# Altium schematic sheet Sheet_Microcontroller.SchDoc
size A2; Organization: Altium Limited; Address1: L3, 12a Rodborough Rd; Address2: Frenchs Forest; Address3: NSW; Address4: Australia 2086
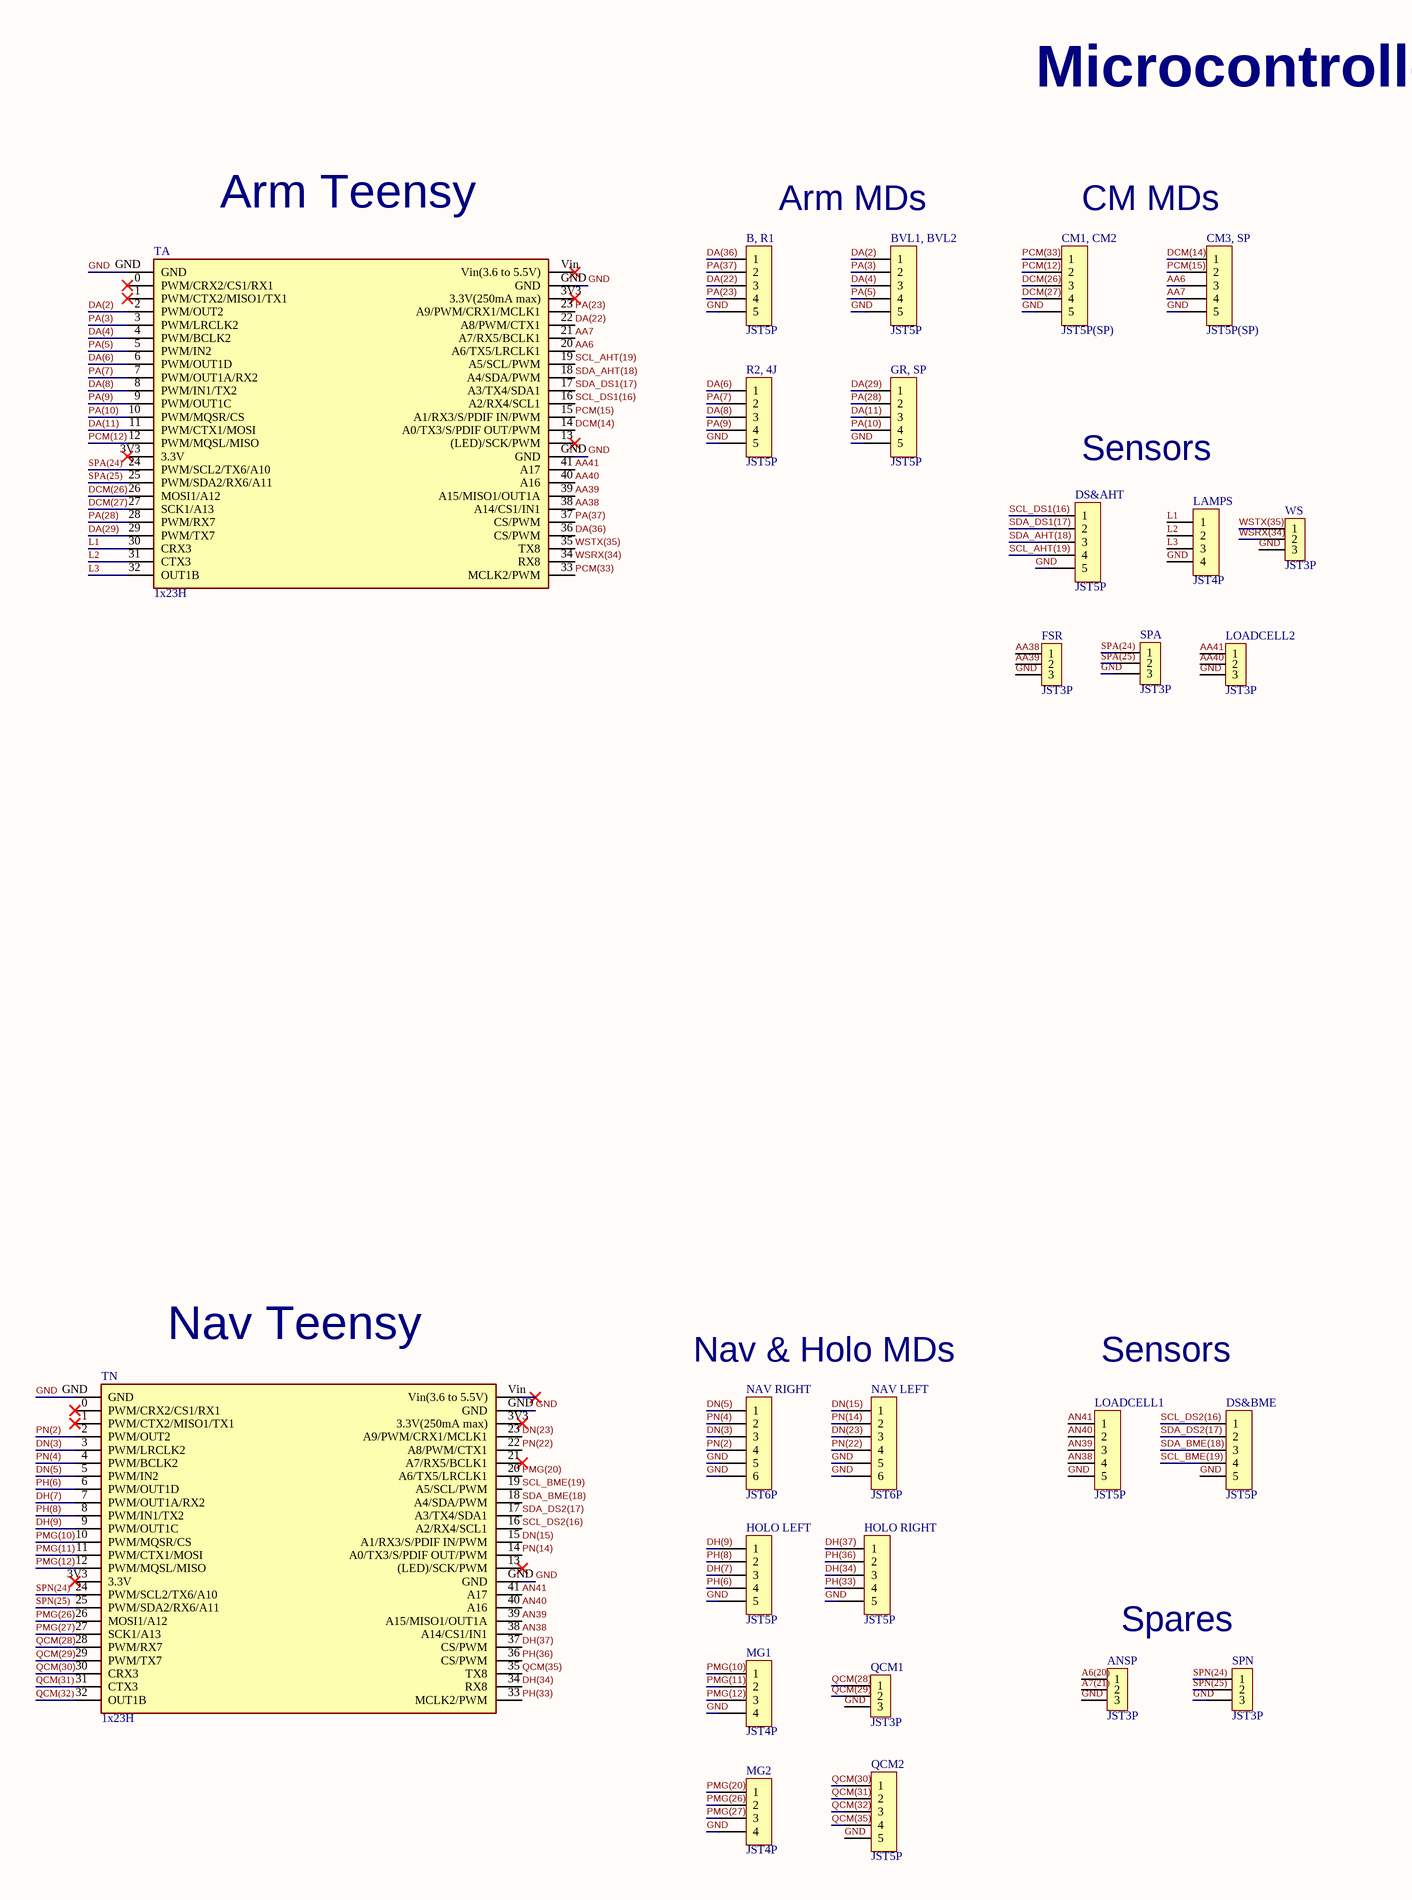
[diagram p0: Sheet_Microcontroller.SchDoc, left]
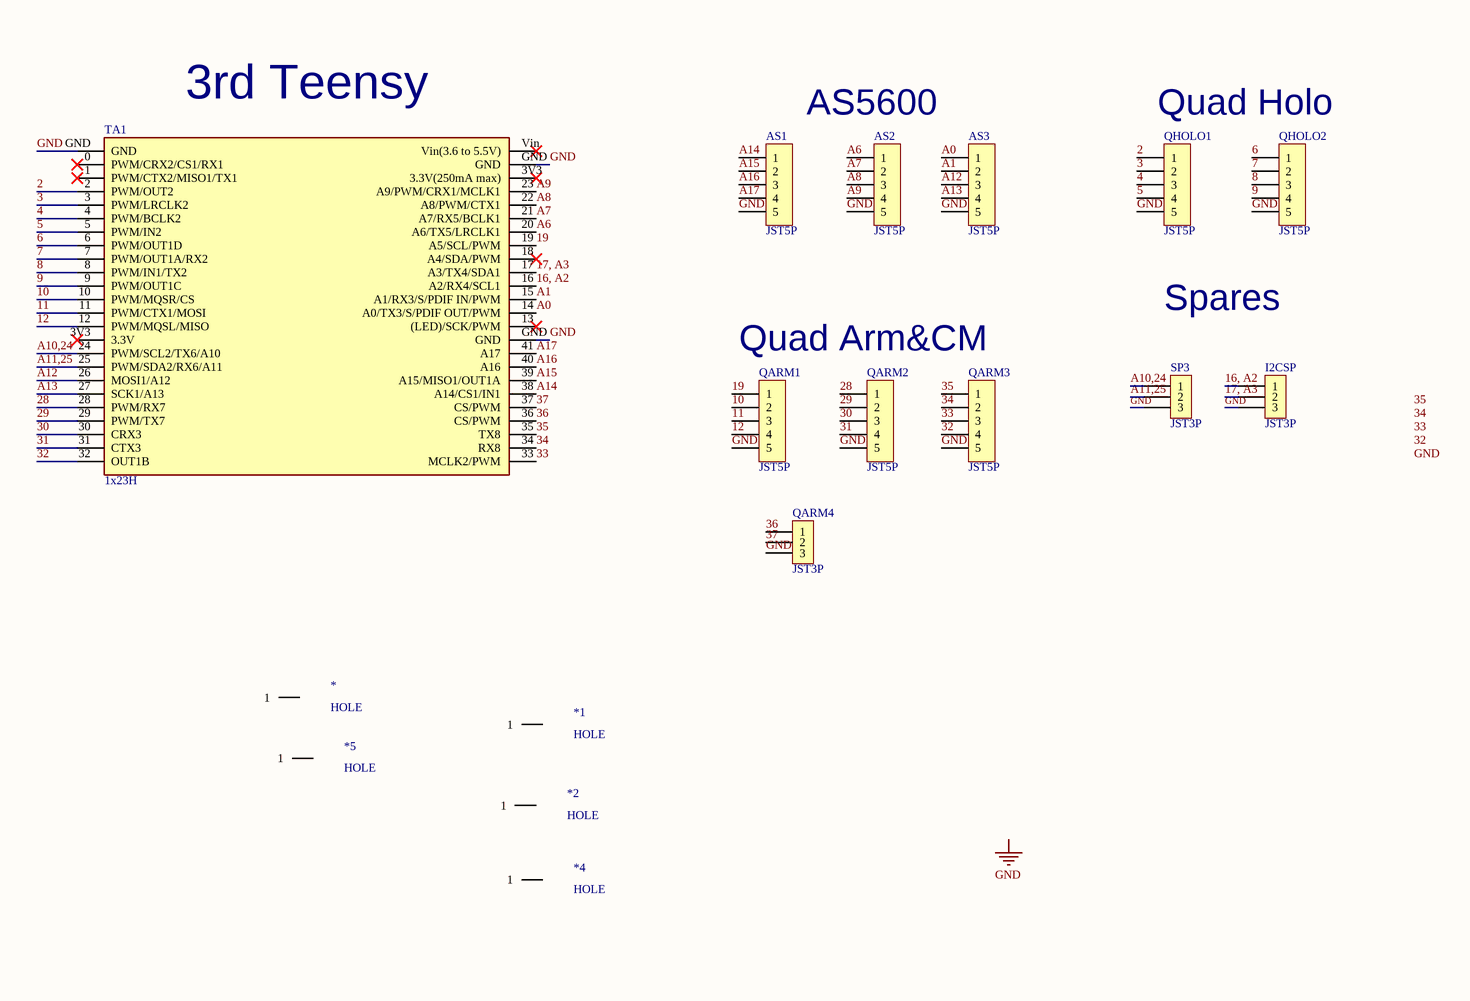
[diagram p1: Sheet_Microcontroller.SchDoc, right]

## Parts
*  HOLE  [HOLE]
*1  HOLE  [HOLE]
*2  HOLE  [HOLE]
*4  HOLE  [HOLE]
*5  HOLE  [HOLE]
ANSP  JST3P  [JST3P]
AS1  JST5P  [JST5P]
AS2  JST5P  [JST5P]
AS3  JST5P  [JST5P]
B,_R1  JST5P  [JST5P]
BVL1,_BVL2  JST5P  [JST5P]
CM1,_CM2  JST5P(SP)  [JST5P]
CM3,_SP  JST5P(SP)  [JST5P]
DS&AHT  JST5P  [JST5P]
DS&BME  JST5P  [JST5P]
FSR  JST3P  [JST3P]
GR,_SP  JST5P  [JST5P]
HOLO_LEFT  JST5P  [JST5P]
HOLO_RIGHT  JST5P  [JST5P]
I2CSP  JST3P  [JST3P]
LAMPS  JST4P  [JST4P]
LOADCELL1  JST5P  [JST5P]
LOADCELL2  JST3P  [JST3P]
MG1  JST4P  [JST4P]
MG2  JST4P  [JST4P]
NAV_LEFT  JST6P  [JST6P]
NAV_RIGHT  JST6P  [JST6P]
QARM1  JST5P  [JST5P]
QARM2  JST5P  [JST5P]
QARM3  JST5P  [JST5P]
QARM4  JST3P  [JST3P]
QCM1  JST3P  [JST3P]
QCM2  JST5P  [JST5P]
QHOLO1  JST5P  [JST5P]
QHOLO2  JST5P  [JST5P]
R2,_4J  JST5P  [JST5P]
SP3  JST3P  [JST3P]
SPA  JST3P  [JST3P]
SPN  JST3P  [JST3P]
TA  1x23H  [TEENSY]
TA1  1x23H  [TEENSY]
TN  1x23H  [TEENSY]
WS  JST3P  [JST3P]

## Nets
GND: ANSP.3 AS1.5 AS2.5 AS3.5 B,_R1.5 BVL1,_BVL2.5 CM1,_CM2.5 CM3,_SP.5 DS&AHT.5 DS&BME.5 FSR.3 GR,_SP.5 HOLO_LEFT.5 HOLO_RIGHT.5 I2CSP.3 LAMPS.4 LOADCELL1.5 LOADCELL2.3 MG1.4 MG2.4 NAV_LEFT.5 NAV_LEFT.6 NAV_RIGHT.5 NAV_RIGHT.6 QARM1.5 QARM2.5 QARM3.5 QARM4.3 QCM1.3 QCM2.5 QHOLO1.5 QHOLO2.5 R2,_4J.5 SP3.3 SPA.3 SPN.3 TA.GND TA1.GND TN.GND WS.3
2: QHOLO1.1 TA1.2(PWM/OUT2)
3: QHOLO1.2 TA1.3(PWM/LRCLK2)
4: QHOLO1.3 TA1.4(PWM/BCLK2)
5: QHOLO1.4 TA1.5(PWM/IN2)
6: QHOLO2.1 TA1.6(PWM/OUT1D)
7: QHOLO2.2 TA1.7(PWM/OUT1A/RX2)
8: QHOLO2.3 TA1.8(PWM/IN1/TX2)
9: QHOLO2.4 TA1.9(PWM/OUT1C)
10: QARM1.2 TA1.10(PWM/MQSR/CS)
11: QARM1.3 TA1.11(PWM/CTX1/MOSI)
12: QARM1.4 TA1.12(PWM/MQSL/MISO)
16, A2: I2CSP.1 TA1.16(A2/RX4/SCL1)
17, A3: I2CSP.2 TA1.17(A3/TX4/SDA1)
19: QARM1.1 TA1.19(A5/SCL/PWM)
28: QARM2.1 TA1.28(PWM/RX7)
29: QARM2.2 TA1.29(PWM/TX7)
30: QARM2.3 TA1.30(CRX3)
31: QARM2.4 TA1.31(CTX3)
32: QARM3.4 TA1.32(OUT1B)
33: QARM3.3 TA1.33(MCLK2/PWM)
34: QARM3.2 TA1.34(RX8)
35: QARM3.1 TA1.35(TX8)
36: QARM4.1 TA1.36(CS/PWM)
37: QARM4.2 TA1.37(CS/PWM)
A0: AS3.1 TA1.14(A0/TX3/S/PDIF_OUT/PWM)
A1: AS3.2 TA1.15(A1/RX3/S/PDIF_IN/PWM)
A6: AS2.1 TA1.20(A6/TX5/LRCLK1)
A6(20): ANSP.1
A7: AS2.2 TA1.21(A7/RX5/BCLK1)
A7(21): ANSP.2
A8: AS2.3 TA1.22(A8/PWM/CTX1)
A9: AS2.4 TA1.23(A9/PWM/CRX1/MCLK1)
A10,24: SP3.1 TA1.24(PWM/SCL2/TX6/A10)
A11,25: SP3.2 TA1.25(PWM/SDA2/RX6/A11)
A12: AS3.3 TA1.26(MOSI1/A12)
A13: AS3.4 TA1.27(SCK1/A13)
A14: AS1.1 TA1.38(A14/CS1/IN1)
A15: AS1.2 TA1.39(A15/MISO1/OUT1A)
A16: AS1.3 TA1.40(A16)
A17: AS1.4 TA1.41(A17)
AA6: CM3,_SP.3 TA.20(A6/TX5/LRCLK1)
AA7: CM3,_SP.4 TA.21(A7/RX5/BCLK1)
AA38: FSR.1 TA.38(A14/CS1/IN1)
AA39: FSR.2 TA.39(A15/MISO1/OUT1A)
AA40: LOADCELL2.2 TA.40(A16)
AA41: LOADCELL2.1 TA.41(A17)
AN38: LOADCELL1.4 TN.38(A14/CS1/IN1)
AN39: LOADCELL1.3 TN.39(A15/MISO1/OUT1A)
AN40: LOADCELL1.2 TN.40(A16)
AN41: LOADCELL1.1 TN.41(A17)
DA(2): BVL1,_BVL2.1 TA.2(PWM/OUT2)
DA(4): BVL1,_BVL2.3 TA.4(PWM/BCLK2)
DA(6): R2,_4J.1 TA.6(PWM/OUT1D)
DA(8): R2,_4J.3 TA.8(PWM/IN1/TX2)
DA(11): GR,_SP.3 TA.11(PWM/CTX1/MOSI)
DA(22): B,_R1.3 TA.22(A8/PWM/CTX1)
DA(29): GR,_SP.1 TA.29(PWM/TX7)
DA(36): B,_R1.1 TA.36(CS/PWM)
DCM(14): CM3,_SP.1 TA.14(A0/TX3/S/PDIF_OUT/PWM)
DCM(26): CM1,_CM2.3 TA.26(MOSI1/A12)
DCM(27): CM1,_CM2.4 TA.27(SCK1/A13)
DH(7): HOLO_LEFT.3 TN.7(PWM/OUT1A/RX2)
DH(9): HOLO_LEFT.1 TN.9(PWM/OUT1C)
DH(34): HOLO_RIGHT.3 TN.34(RX8)
DH(37): HOLO_RIGHT.1 TN.37(CS/PWM)
DN(3): NAV_RIGHT.3 TN.3(PWM/LRCLK2)
DN(5): NAV_RIGHT.1 TN.5(PWM/IN2)
DN(15): NAV_LEFT.1 TN.15(A1/RX3/S/PDIF_IN/PWM)
DN(23): NAV_LEFT.3 TN.23(A9/PWM/CRX1/MCLK1)
L1: LAMPS.1 TA.30(CRX3)
L2: LAMPS.2 TA.31(CTX3)
L3: LAMPS.3 TA.32(OUT1B)
PA(3): BVL1,_BVL2.2 TA.3(PWM/LRCLK2)
PA(5): BVL1,_BVL2.4 TA.5(PWM/IN2)
PA(7): R2,_4J.2 TA.7(PWM/OUT1A/RX2)
PA(9): R2,_4J.4 TA.9(PWM/OUT1C)
PA(10): GR,_SP.4 TA.10(PWM/MQSR/CS)
PA(23): B,_R1.4 TA.23(A9/PWM/CRX1/MCLK1)
PA(28): GR,_SP.2 TA.28(PWM/RX7)
PA(37): B,_R1.2 TA.37(CS/PWM)
PCM(12): CM1,_CM2.2 TA.12(PWM/MQSL/MISO)
PCM(15): CM3,_SP.2 TA.15(A1/RX3/S/PDIF_IN/PWM)
PCM(33): CM1,_CM2.1 TA.33(MCLK2/PWM)
PH(6): HOLO_LEFT.4 TN.6(PWM/OUT1D)
PH(8): HOLO_LEFT.2 TN.8(PWM/IN1/TX2)
PH(33): HOLO_RIGHT.4 TN.33(MCLK2/PWM)
PH(36): HOLO_RIGHT.2 TN.36(CS/PWM)
PMG(10): MG1.1 TN.10(PWM/MQSR/CS)
PMG(11): MG1.2 TN.11(PWM/CTX1/MOSI)
PMG(12): MG1.3 TN.12(PWM/MQSL/MISO)
PMG(20): MG2.1 TN.20(A6/TX5/LRCLK1)
PMG(26): MG2.2 TN.26(MOSI1/A12)
PMG(27): MG2.3 TN.27(SCK1/A13)
PN(2): NAV_RIGHT.4 TN.2(PWM/OUT2)
PN(4): NAV_RIGHT.2 TN.4(PWM/BCLK2)
PN(14): NAV_LEFT.2 TN.14(A0/TX3/S/PDIF_OUT/PWM)
PN(22): NAV_LEFT.4 TN.22(A8/PWM/CTX1)
QCM(28): QCM1.1 TN.28(PWM/RX7)
QCM(29): QCM1.2 TN.29(PWM/TX7)
QCM(30): QCM2.1 TN.30(CRX3)
QCM(31): QCM2.2 TN.31(CTX3)
QCM(32): QCM2.3 TN.32(OUT1B)
QCM(35): QCM2.4 TN.35(TX8)
SCL_AHT(19): DS&AHT.4 TA.19(A5/SCL/PWM)
SCL_BME(19): DS&BME.4 TN.19(A5/SCL/PWM)
SCL_DS1(16): DS&AHT.1 TA.16(A2/RX4/SCL1)
SCL_DS2(16): DS&BME.1 TN.16(A2/RX4/SCL1)
SDA_AHT(18): DS&AHT.3 TA.18(A4/SDA/PWM)
SDA_BME(18): DS&BME.3 TN.18(A4/SDA/PWM)
SDA_DS1(17): DS&AHT.2 TA.17(A3/TX4/SDA1)
SDA_DS2(17): DS&BME.2 TN.17(A3/TX4/SDA1)
SPA(24): SPA.1 TA.24(PWM/SCL2/TX6/A10)
SPA(25): SPA.2 TA.25(PWM/SDA2/RX6/A11)
SPN(24): SPN.1 TN.24(PWM/SCL2/TX6/A10)
SPN(25): SPN.2 TN.25(PWM/SDA2/RX6/A11)
WSRX(34): TA.34(RX8) WS.2
WSTX(35): TA.35(TX8) WS.1

Not connected (* = marked no-connect by the designer): * 1; *1 1; *2 1; *4 1; *5 1; TA 0(PWM/CRX2/CS1/RX1)* 1(PWM/CTX2/MISO1/TX1)* 3V3(3.3V(250mA_max))* 13((LED)/SCK/PWM)* Vin(Vin(3.6_to_5.5V))*; TA1 0(PWM/CRX2/CS1/RX1)* 1(PWM/CTX2/MISO1/TX1)* 3V3(3.3V(250mA_max))* 13((LED)/SCK/PWM)* 18(A4/SDA/PWM)* Vin(Vin(3.6_to_5.5V))*; TN 0(PWM/CRX2/CS1/RX1)* 1(PWM/CTX2/MISO1/TX1)* 3V3(3.3V(250mA_max))* 13((LED)/SCK/PWM)* 21(A7/RX5/BCLK1)* Vin(Vin(3.6_to_5.5V))*

## Notes on the sheet
- Microcontrollers PCB
- Arm Teensy
- Arm MDs
- CM MDs
- Sensors
- (near TA1) 3rd Teensy
- AS5600
- Quad Holo
- Quad Arm&CM
- Spares
- (near TN) Nav Teensy
- Nav & Holo MDs
- Labels drawn without touching a wire or pin: 32, 33, 34, 35, GND
- Title
- Size:
- Date:
- File:
- A2
- Number:
- Time:
- Revision:
- Sheet
- of

## Library data of the parts
CM1,_CM2 CM3,_SP = JST5P